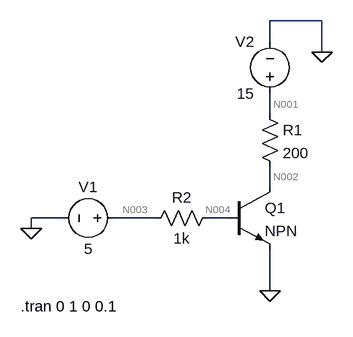
[diagram p0: schematic EJ1.asc]
EJ1.asc, the LTspice schematic file:
Version 4
SHEET 1 880 680
WIRE 336 -288 256 -288
WIRE 256 -256 256 -288
WIRE 336 -240 336 -288
WIRE 256 -144 256 -176
WIRE 256 -32 256 -64
WIRE -64 16 -112 16
WIRE 80 16 16 16
WIRE 192 16 160 16
WIRE -112 32 -112 16
WIRE 256 128 256 64
FLAG 256 128 0
FLAG -112 32 0
FLAG 336 -240 0
SYMBOL npn 192 -32 R0
SYMATTR InstName Q1
SYMBOL res 240 -160 R0
SYMATTR InstName R1
SYMATTR Value 200
SYMBOL res 64 32 R270
WINDOW 0 32 56 VTop 2
WINDOW 3 0 56 VBottom 2
SYMATTR InstName R2
SYMATTR Value 1k
SYMBOL voltage 32 16 R90
WINDOW 0 -32 56 VBottom 2
WINDOW 3 32 56 VTop 2
WINDOW 123 0 0 Left 0
WINDOW 39 0 0 Left 0
SYMATTR InstName V1
SYMATTR Value 5
SYMBOL voltage 256 -160 R180
WINDOW 0 24 96 Left 2
WINDOW 3 24 16 Left 2
WINDOW 123 0 0 Left 0
WINDOW 39 0 0 Left 0
SYMATTR InstName V2
SYMATTR Value 15
TEXT -128 152 Left 2 !.tran 0 1 0 0.1

The netlist it stands for:
* EJ1.asc
Q1 N002 N004 0 0 NPN
R1 N001 N002 200
R2 N003 N004 1k
V1 N003 0 5
V2 N001 0 15
.model NPN NPN
.model PNP PNP
.lib standard.bjt
.tran 0 1 0 0.1
.backanno
.end

* Results of the author's LTspice run, read from the files saved beside the schematic
* Operating Point, zero values left out:
*   V(n002) = 82.84 mV
*   V(n004) = 888 mV
*   V(n001) = 15 V
*   V(n003) = 5 V
*   Ic(Q1) = 74.59 mA
*   Ib(Q1) = 4.112 mA
*   Ie(Q1) = -78.7 mA
*   I(R1) = 74.59 mA
*   I(R2) = 4.112 mA
*   I(V1) = -4.112 mA
*   I(V2) = -74.59 mA
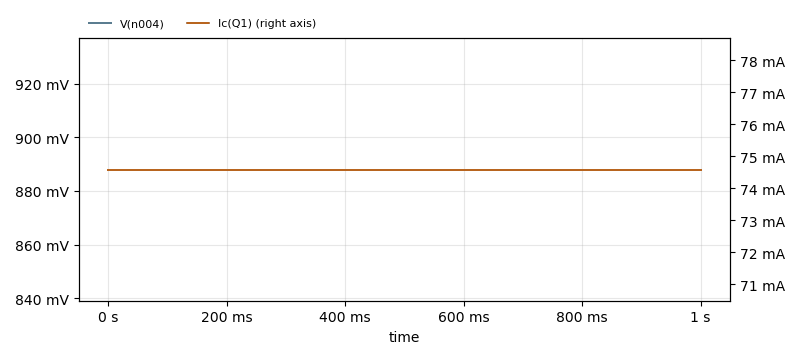
[diagram p1: Transient Analysis of EJ1.asc, plotted from the saved traces]
* Transient Analysis, 1 run:
*   V(n004): min 888 mV, max 888 mV, average 888 mV, rms 888 mV, last 888 mV
*   Ic(Q1): min 74.59 mA, max 74.59 mA, average 74.59 mA, rms 74.59 mA, last 74.59 mA